# EAGLE design SimpleTrigger (EAGLE 6.5.0)
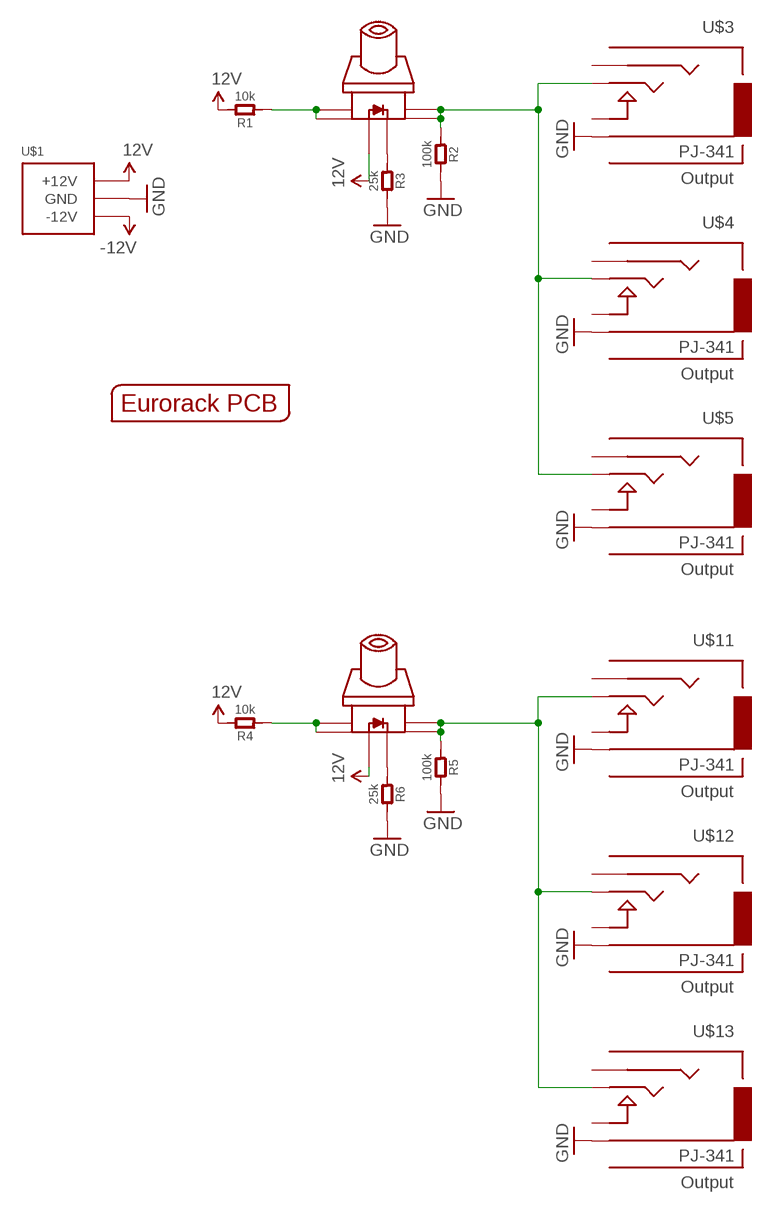
[diagram p0: schematic, sheet 1]

## Parts
R1  10k  R-0603  [R0603]
R2  100k  R-0603  [R0603]
R3  25k  R-0603  [R0603]
R4  10k  R-0603  [R0603]
R5  100k  R-0603  [R0603]
R6  25k  R-0603  [R0603]
U$1  POWER_SIMPLE10  [POWER_10]
U$2  SWITCH_W_LED_PB6149L-X-102WHITE  [PB6149L]
U$3  PJ-341  AUDIO-JACKOUTPUT  [3.5MM-JACK-SWITCH-13MM-OUTPUT]
U$4  PJ-341  AUDIO-JACKOUTPUT  [3.5MM-JACK-SWITCH-13MM-OUTPUT]
U$5  PJ-341  AUDIO-JACKOUTPUT  [3.5MM-JACK-SWITCH-13MM-OUTPUT]
U$9  EURORACK_PCB2HP  [EURORACK2HPPCB]
U$10  SWITCH_W_LED_PB6149L-X-102WHITE  [PB6149L]
U$11  PJ-341  AUDIO-JACKOUTPUT  [3.5MM-JACK-SWITCH-13MM-OUTPUT]
U$12  PJ-341  AUDIO-JACKOUTPUT  [3.5MM-JACK-SWITCH-13MM-OUTPUT]
U$13  PJ-341  AUDIO-JACKOUTPUT  [3.5MM-JACK-SWITCH-13MM-OUTPUT]

## Nets
12V: R1.2 R4.2 U$1.9(+12V) U$1.10(+12V) U$2.LEDPOS(POS) U$10.LEDPOS(POS)
-12V: U$1.1(-12V) U$1.2(-12V)
GND: R2.2 R3.2 R5.2 R6.2 U$1.3(GND) U$1.4(GND) U$1.5(GND) U$1.6(GND) U$1.7(GND) U$1.8(GND) U$3.RING@3(RING) U$4.RING@3(RING) U$5.RING@3(RING) U$11.RING@3(RING) U$12.RING@3(RING) U$13.RING@3(RING)
N$1: R3.1 U$2.LEDNEG(NEG)
N$2: R1.1 U$2.1 U$2.2
N$3: R2.1 U$2.3 U$2.4 U$3.TIP@3(TIP) U$4.TIP@3(TIP) U$5.TIP@3(TIP)
N$4: R6.1 U$10.LEDNEG(NEG)
N$5: R4.1 U$10.1 U$10.2
N$6: R5.1 U$10.3 U$10.4 U$11.TIP@3(TIP) U$12.TIP@3(TIP) U$13.TIP@3(TIP)
Unconnected: U$3.SECOND@3(SECOND) U$3.SWITCH@3(SWITCH) U$4.SECOND@3(SECOND) U$4.SWITCH@3(SWITCH) U$5.SECOND@3(SECOND) U$5.SWITCH@3(SWITCH) U$11.SECOND@3(SECOND) U$11.SWITCH@3(SWITCH) U$12.SECOND@3(SECOND) U$12.SWITCH@3(SWITCH) U$13.SECOND@3(SECOND) U$13.SWITCH@3(SWITCH)

## Library data of the parts
R1-R6 = OPL:R*
U$1 = EurorackModularParts:POWER_SIMPLE
U$2 U$10 = zephod-components:SWITCH_W_LED_PB6149L-X-102
U$3-U$5 U$11-U$13 = EurorackModularParts:AUDIO-JACK: Switching Mono 3.5mm Audio Jack from Erthenvar.; DESC: Output; MPN: PJ-341
U$9 = EurorackModularParts:EURORACK_PCB

## Board
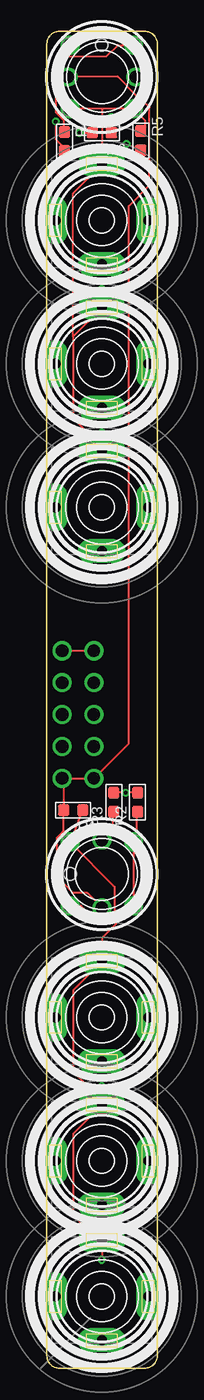
[diagram p1: board, top side]
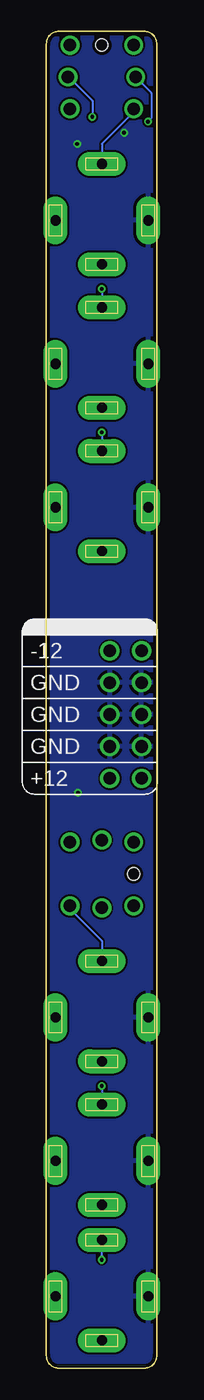
[diagram p2: board, bottom side, seen from below]

Size 8.82 x 106.5 mm. Coordinates in mm from the lower left corner, seen from the top.
Copper layers (1*16): Top 0.035mm / dielectric 1.5mm / Bottom 0.035mm
Design rules "ITEADstudio_DRC": minimum track width 6mil, minimum drill 12mil, track to track 6mil, track to pad 6mil, pad to pad 6mil, via to via 6mil, smd to smd 0mil, copper to edge 10mil, drill to drill 10mil, minimum pad ring 10mil, minimum via ring 6mil, stop-mask expansion 2mil, vias tented up to drill 100mil, thermal gap 10mil

### Footprints (pad centres in the part's own frame; a part is rotated, then mirrored left to right if it is on the bottom)
R0603 = smd 0.889 x 0.889: 1 -0.762,0; 2 0.762,0
POWER_10 = drill 1.016: 1 -5.08,-1.27; 2 -5.08,1.27; 3 -2.54,-1.27; 4 -2.54,1.27; 5 0,-1.27; 6 0,1.27; 7 2.54,-1.27; 8 2.54,1.27; 9 5.08,-1.27; 10 5.08,1.27
PB6149L = drill 1: 1 2.54,2.54; 2 2.54,-2.54; 3 -2.54,2.54; 4 -2.54,-2.54; LEDNEG 0,-2.7; LEDPOS 0,2.7 | hole 1: 2.54,0
3.5MM-JACK-SWITCH-13MM-OUTPUT = drill 0.8 pad 1.93 long: RING@3 -3.7,0; SECOND@3 0,-3.5; SWITCH@3 3.7,0; TIP@3 0,4.5

### Placement (x,y rotation side)
R1  2.1,44.45 180 top
R2  7.25,45.09 90 top
R3  5.34,45.09 90 top
R4  1.4,97.73 270 top
R5  7.5,97.79 270 top
R6  4.39,98.42 180 top
U$1  2.48,52.07 270 bottom
U$2  4.39,39.37 180 top
U$3  4.39,16.51 0 top
U$4  4.39,5.71 0 top
U$5  4.39,27.94 0 top
U$9  -0.5,0 0 top
U$10  4.39,102.87 90 top
U$11  4.39,68.58 0 top
U$12  4.39,80.01 0 top
U$13  4.39,91.44 0 top

### Tracks (layer width: path | path; a pad name or v marks a point on that pad's centre or on a via)
12V  (via drill 0.3)
  Top 0.152: 1.34,46.99 U$1.9 6.55,49.78 6.55,92.58 8.2,94.23 8.2,100.46 7.31,101.35 7.18,101.35 5.66,102.87 U$10.LEDPOS | 1.34,46.99 R1.2 1.34,42.8 0.83,42.29 0.83,39.12 2.1,37.85 3.25,37.85 4.39,36.7 U$2.LEDPOS | 1.34,46.99 U$1.10 | v0.71,99.31 0.71,97.92 1.34,97.28 1.34,97.03 R4.2
  Bottom 0.152: v0.71,99.31 0.45,99.57 0.45,101.6 1.72,102.87 U$10.LEDPOS
-12V
  Top 0.152: U$1.1 U$1.2
GND  (via drill 0.3)
  Top 0.152: R2.2 v6.29,45.85 R3.2 | v2.61,98.42 R6.2 | v6.36,97.54 R5.2
  pour Bottom: -3.23,109.22 22.17,109.22 22.17,-5.08 -3.23,-5.08
N$1
  Top 0.152: R3.1 5.28,44.32 5.28,43.05 4.39,42.16 U$2.LEDNEG
N$2
  Top 0.152: R1.1 1.98,42.04 U$2.2 5.41,38.35 5.41,36.2 4.9,35.69 3.88,35.69 2.74,36.83 U$2.1
N$3  (via drill 0.3)
  Top 0.152: v4.39,8.64 U$4.TIP@3 4.39,10.29 4.01,10.29 2.1,12.19 2.1,18.67 4.39,20.95 U$3.TIP@3 v4.39,22.48 3.25,22.48 2.1,23.62 2.1,30.1 4.39,32.38 U$5.TIP@3 4.39,34.29 U$2.3 U$2.4 7.18,42.16 7.18,44.32 R2.1
  Bottom 0.152: v4.39,8.64 U$4.TIP@3 | v4.39,22.48 U$3.TIP@3 | U$5.TIP@3 4.39,34.04 6.93,36.58 U$2.3
N$4  (via drill 0.3)
  Top 0.152: v5.15,99.69 R6.1
  Bottom 0.152: v5.15,99.69 5.15,100.97 7.06,102.87 U$10.LEDNEG
N$5
  Top 0.152: U$10.1 0.96,104.52 | 0.96,104.52 0.71,104.27 0.71,100.08 1.34,99.44 1.34,98.55 R4.1 | U$10.2 5.66,105.41 4.77,104.52 0.96,104.52
N$6  (via drill 0.3)
  Top 0.152: R5.1 7.82,98.55 7.82,99.44 U$10.4 4.39,100.33 | 4.39,100.33 U$10.3 | 4.39,100.33 U$13.TIP@3 4.39,95.89 2.1,93.6 2.1,82.17 | U$11.TIP@3 v4.39,74.55 3.25,74.55 2.1,75.69 2.1,82.17 | 2.1,82.17 4.39,84.45 U$12.TIP@3 v4.39,85.98
  Bottom 0.152: U$13.TIP@3 4.39,97.54 1.85,100.08 U$10.3 | v4.39,74.55 U$11.TIP@3 | v4.39,85.98 U$12.TIP@3